# Altium schematic sheet MAGI'sBatteryPowerMega-Python.SchDoc
size A4
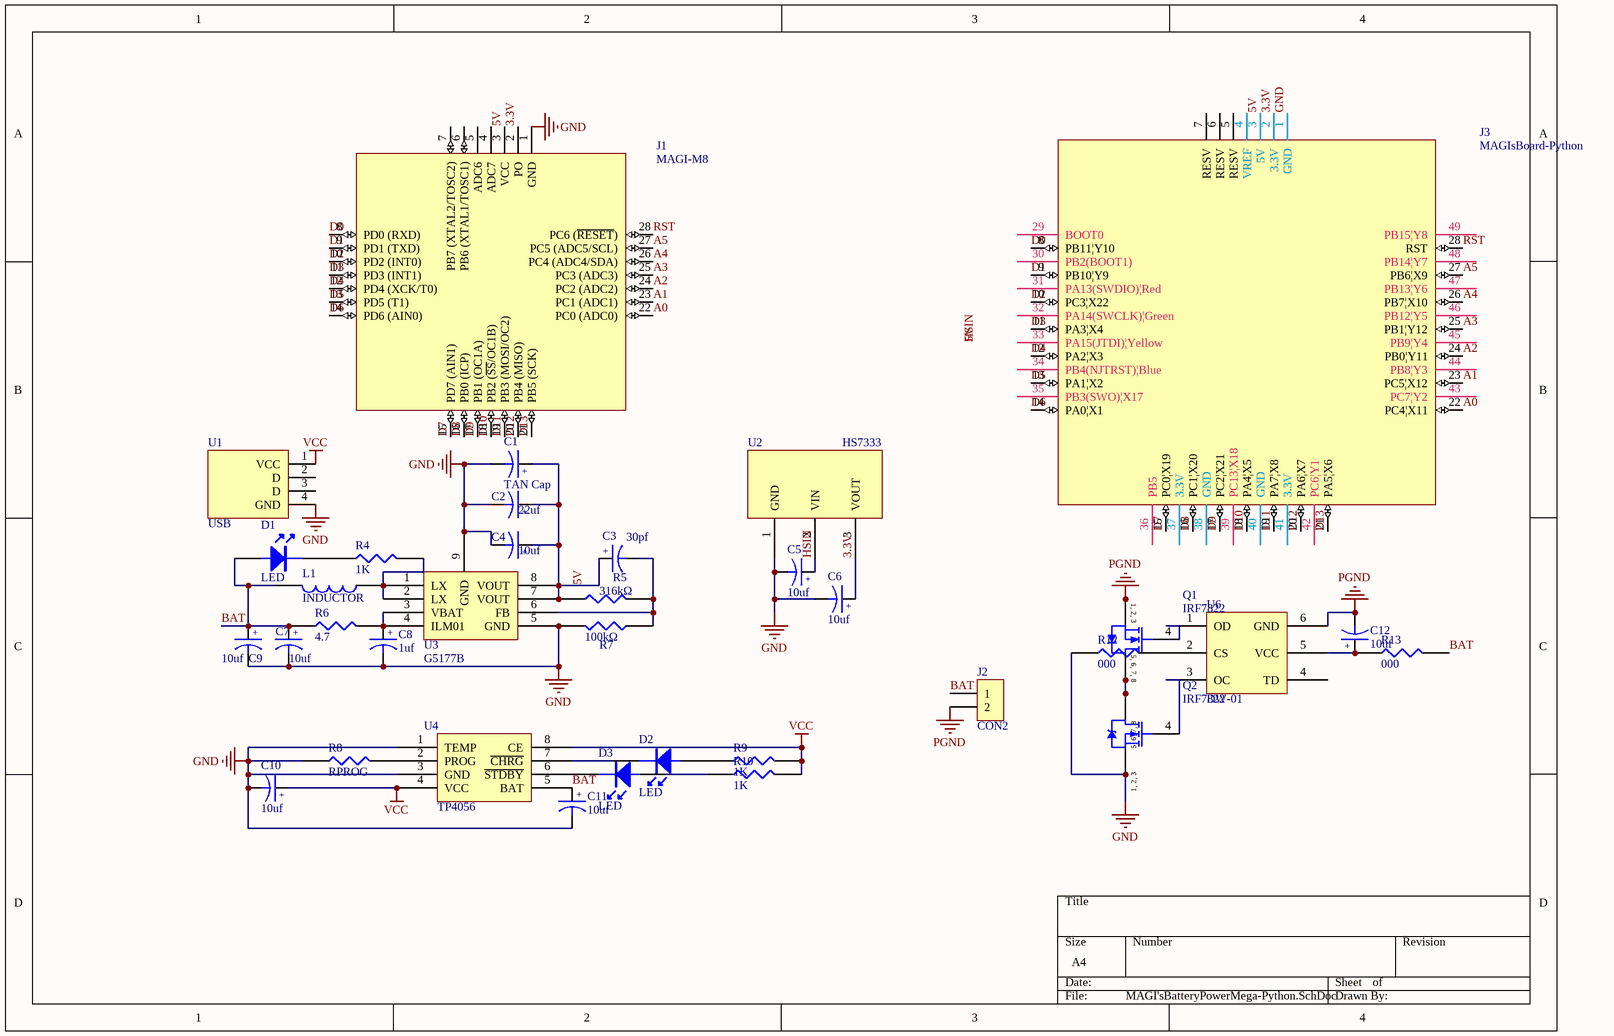
[diagram p0: MAGI'sBatteryPowerMega-Python.SchDoc]

## Parts
C1  TAN Cap  [TAN-D-7343]
C2  22uf  [14-1210]
C3  30pf  [6-0805_N]
C4  10uf  [6-0805_N]
C5  10uf  [6-0805_N]
C6  10uf  [6-0805_N]
C7  10uf  [6-0805_N]
C8  1uf  [6-0805_N]
C9  10uf  [6-0805_N]
C10  10uf  [6-0805_N]
C11  10uf  [6-0805_N]
C12  10uf  [6-0805_N]
D1  LED  [6-0805_N]
D2  LED  [6-0805_N]
D3  LED  [6-0805_N]
J1  MAGI-M8  [MAGI-M8]
J2  CON2  [18650]
J3  MAGIsBoard-Python  [MAGIsBoard-Python]
L1  INDUCTOR  [7*7]
Q1  IRF7822  [SO-8_N]
Q2  IRF7822  [SO-8_N]
R4  1K  [6-0805_N]
R5  316kΩ  [6-0805_N]
R6  4.7  [6-0805_N]
R7  100kΩ  [6-0805_N]
R8  RPROG  [6-0805_N]
R9  1K  [6-0805_N]
R10  1K  [6-0805_N]
R12  000  [6-0805_n]
R13  000  [6-0805_n]
U1  USB  [MicroUSB]
U2  HS7333  [HS7333]
U3  G5177B  [G5177B]
U4  TP4056  [TP4056]
U6  DW-01  [TPS2513]

## Nets
GND: C1.2 C2.2 C4.2 C5.2 C6.2 C7.2 C8.2 C9.2 C10.2 C11.2 J1.1(GND) J3.1(GND) Q2.1(S) Q2.2(S) Q2.3(S) R7.2 R8.1 R12.1 U1.4(GND) U2.1(GND) U3.5(GND) U3.9(GND) U4.1(TEMP) U4.3(GND)
PGND: C12.2 J2.2 Q1.1(S) Q1.2(S) Q1.3(S) U6.6(GND)
VCC: C10.1 R9.2 R10.2 U1.1(VCC) U4.4(VCC) U4.8(CE)
3.3V: C6.1 J1.2(PO) J3.2(3.3V) U2.3(VOUT)
5V: C1.1 C2.1 C3.1 C4.1 C5.1 J1.3(VCC) J3.3(5V) R5.1 U2.2(VIN) U3.7(VOUT) U3.8(VOUT)  [also labelled HSIN]
A0: J1.22(PC0_(ADC0)) J3.22(PC4|X11)
A1: J1.23(PC1_(ADC1)) J3.23(PC5|X12)
A2: J1.24(PC2_(ADC2)) J3.24(PB0|Y11)
A3: J1.25(PC3_(ADC3)) J3.25(PB1|Y12)
A4: J1.26(PC4_(ADC4/SDA)) J3.26(PB7|X10)
A5: J1.27(PC5_(ADC5/SCL)) J3.27(PB6|X9)
BAT: C7.1 C9.1 C11.1 D1.1 J2.1 L1.2 R6.1 R13.2 U4.5(BAT)
D0: J1.8(PD0_(RXD)) J3.8(PB11|Y10)
D1: J1.9(PD1_(TXD)) J3.9(PB10|Y9)
D2: J1.10(PD2_(INT0)) J3.10(PC3|X22)
D3: J1.11(PD3_(INT1)) J3.11(PA3|X4)
D4: J1.12(PD4_(XCK/T0)) J3.12(PA2|X3)
D5: J1.13(PD5_(T1)) J3.13(PA1|X2)
D6: J1.14(PD6_(AIN0)) J3.14(PA0|X1)
D7: J1.15(PD7_(AIN1)) J3.15(PC0|X19)
D8: J1.16(PB0_(ICP)) J3.16(PC1|X20)
D9: J1.17(PB1_(OC1A)) J3.17(PC2|X21)
D10: J1.18(PB2_(~{SS}/OC1B)) J3.18(PA4|X5)
D11: J1.19(PB3_(MOSI/OC2)) J3.19(PA7|X8)
D12: J1.20(PB4_(MISO)) J3.20(PA6|X7)
D13: J1.21(PB5_(SCK)) J3.21(PA5|X6)
RST: J1.28(PC6_(~{RESET})) J3.28(RST)
NetC3_2: C3.2 R5.2 R7.1 U3.6(FB)
NetC8_1: C8.1 R6.2 U3.3(VBAT) U3.4(ILM01)
NetC12_1: C12.1 R13.1 U6.5(VCC)
NetD1_2: D1.2 R4.1
NetD2_1: D2.1 R9.1
NetD2_2: D2.2 U4.7(~{CHRG})
NetD3_1: D3.1 R10.1
NetD3_2: D3.2 U4.6(~{STDBY})
NetL1_1: L1.1 R4.2 U3.1(LX) U3.2(LX)
NetQ1_4: Q1.4(G) U6.1(OD)
NetQ1_5: Q1.5(D) Q1.6(D) Q1.7(D) Q1.8(D) Q2.5(D) Q2.6(D) Q2.7(D) Q2.8(D)
NetQ2_4: Q2.4(G) U6.3(OC)
NetR8_2: R8.2 U4.2(PROG)
NetR12_2: R12.2 U6.2(CS)

Not connected (* = marked no-connect by the designer): J1 4(ADC7) 5(ADC6) 6(PB6_(XTAL1/TOSC1)) 7(PB7_(XTAL2/TOSC2)); J3 4(VREF) 5(RESV) 6(RESV) 7(RESV) 29(BOOT0) 30(PB2(BOOT1)) 31(PA13(SWDIO)|Red) 32(PA14(SWCLK)|Green) 33(PA15(JTDI)|Yellow) 34(PB4(NJTRST)|Blue) 35(PB3(SWO)|X17) 36(PB5) 37(3.3V) 38(GND) 39(PC13|X18) 40(GND) 41(3.3V) 42(PC6|Y1) 43(PC7|Y2) 44(PB8|Y3) 45(PB9|Y4) 46(PB12|Y5) 47(PB13|Y6) 48(PB14|Y7) 49(PB15|Y8); U1 2(D) 3(D); U6 4(TD)

## Notes on the sheet
- (in symbol CAPACITOR POL) +
- (in symbol IRF7822) 1, 2, 3; 5, 6, 7, 8

## Library data of the parts
C1-C12 = CAPACITOR POL: Capacitor
J2 = CON2: Connector
Q1 Q2 = IRF7822: HEXFET Power MOSFET; Published: 17-Sep-2003; LatestRevisionDate: 13-Apr-2006; LatestRevisionNote: IPC-7351 Footprint Added.; DatasheetVersion: 11-Jul-2001; PackageVersion: Feb-2001; PackageReference: SO-8; Publisher: Altium Limited; PackageDescription: 8-Pin Plastic Small Outline Integrated Circuit 1.27 mm Pitch; Code_JEDEC: MS-012-AA; Code_IPC: SOIC127P600-8; ComponentLink1Description: Manufacturer Link; ComponentLink1URL: http://www.irf.com/; ComponentLink2Description: Datasheet; ComponentLink2URL: http://www.irf.com/product-info/datasheets/data/irf7822.pdf
R4-R10 R12 R13 = RES1
U6 = TPS2513